# EAGLE design 30EC14-43EC14 (EAGLE 8.1.0)
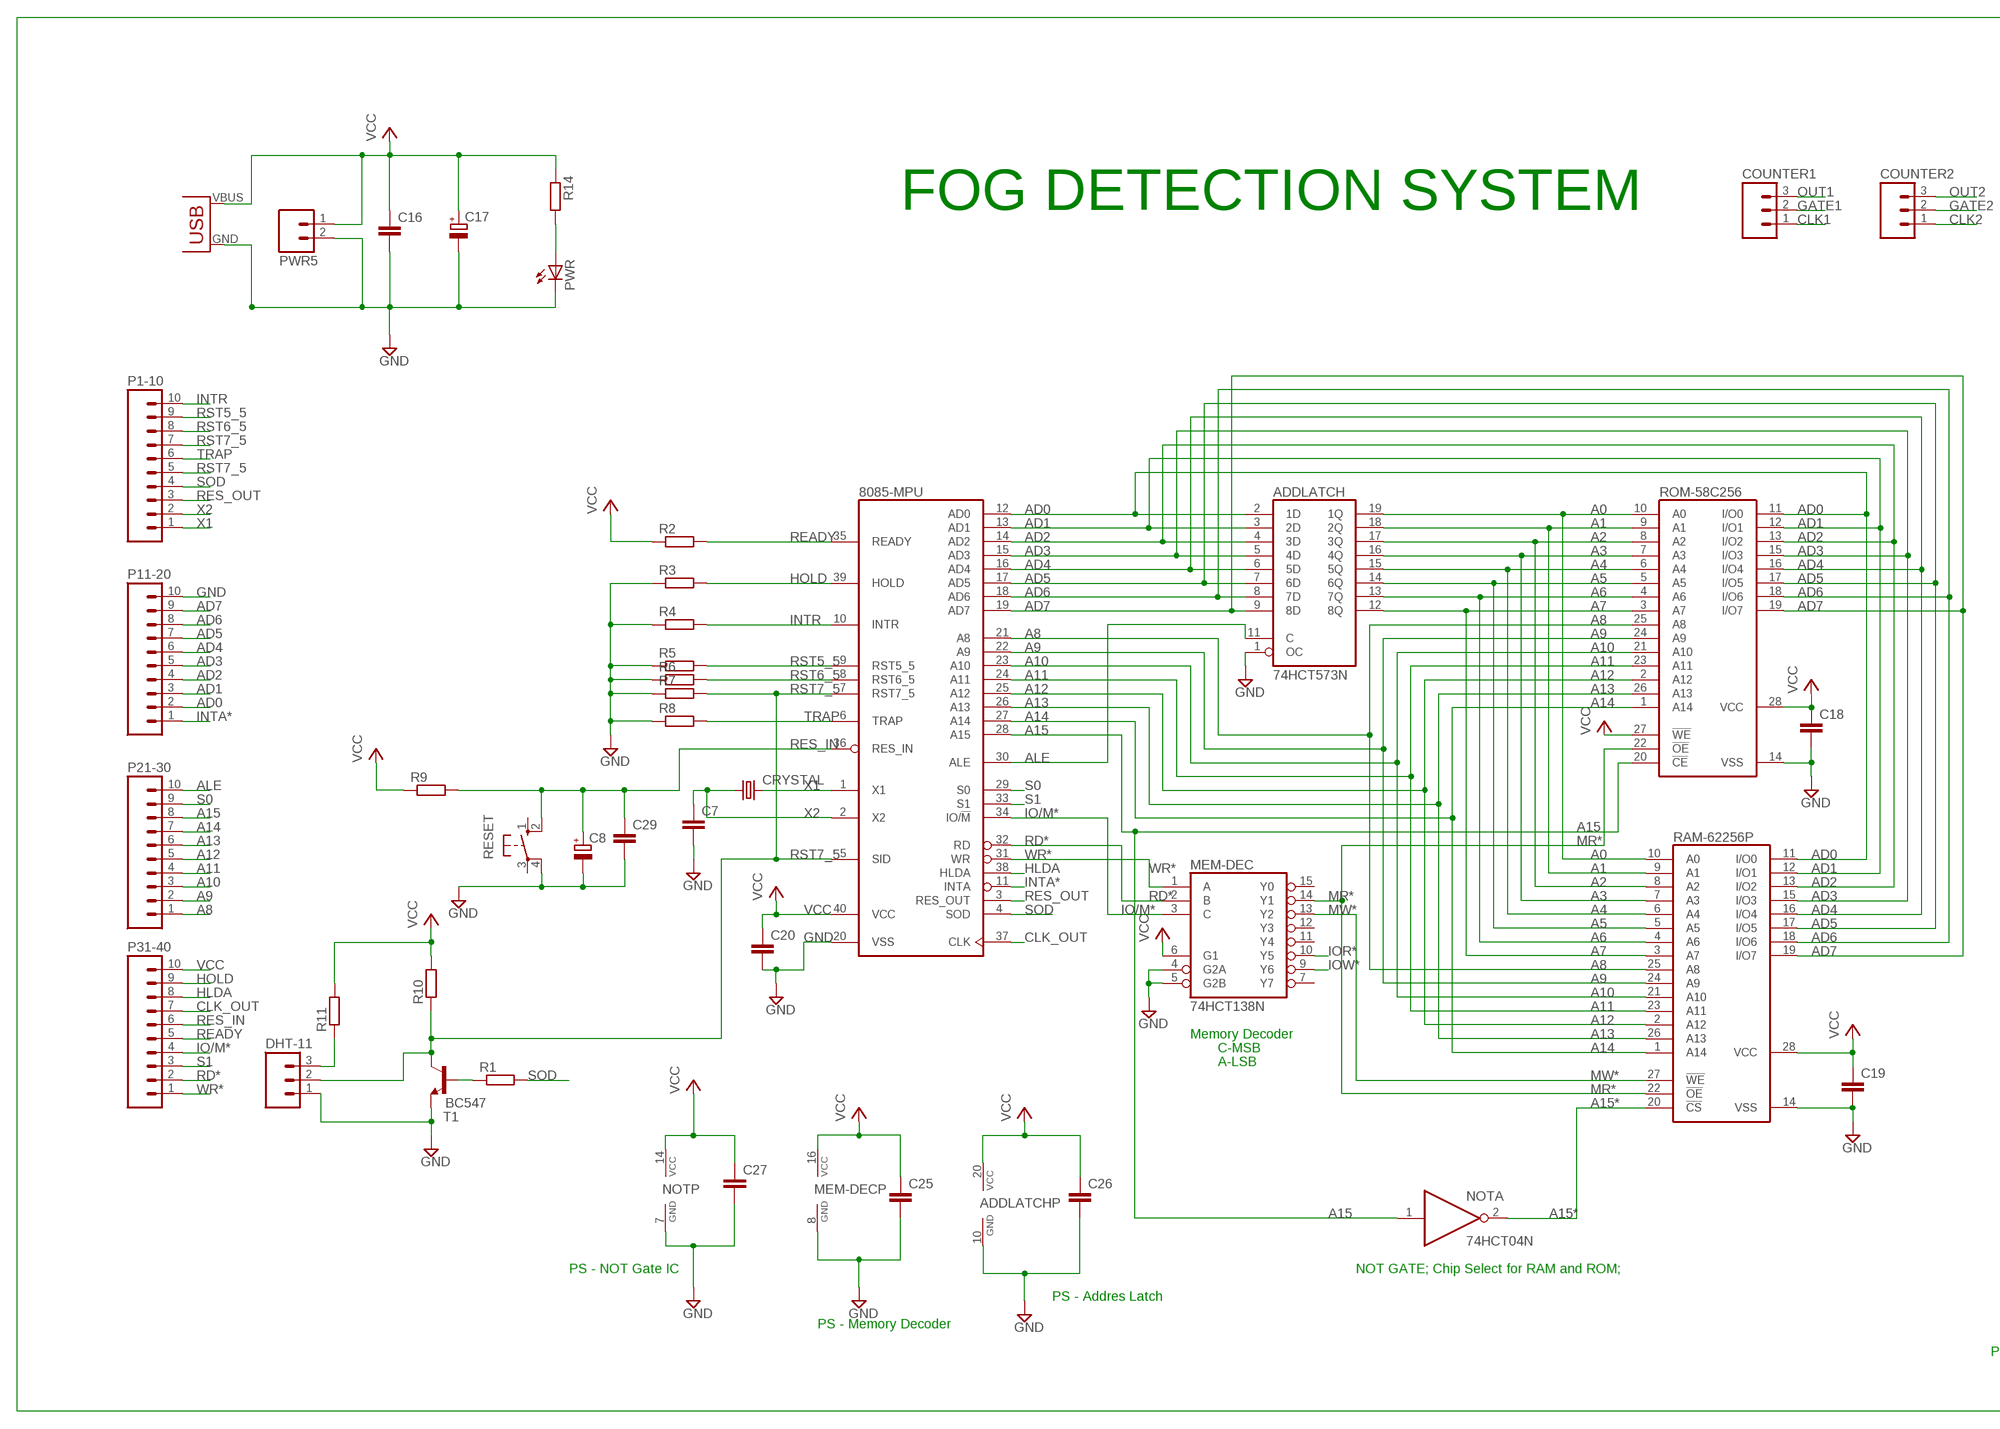
[diagram p0: schematic, sheet 1, part 1 of 2]
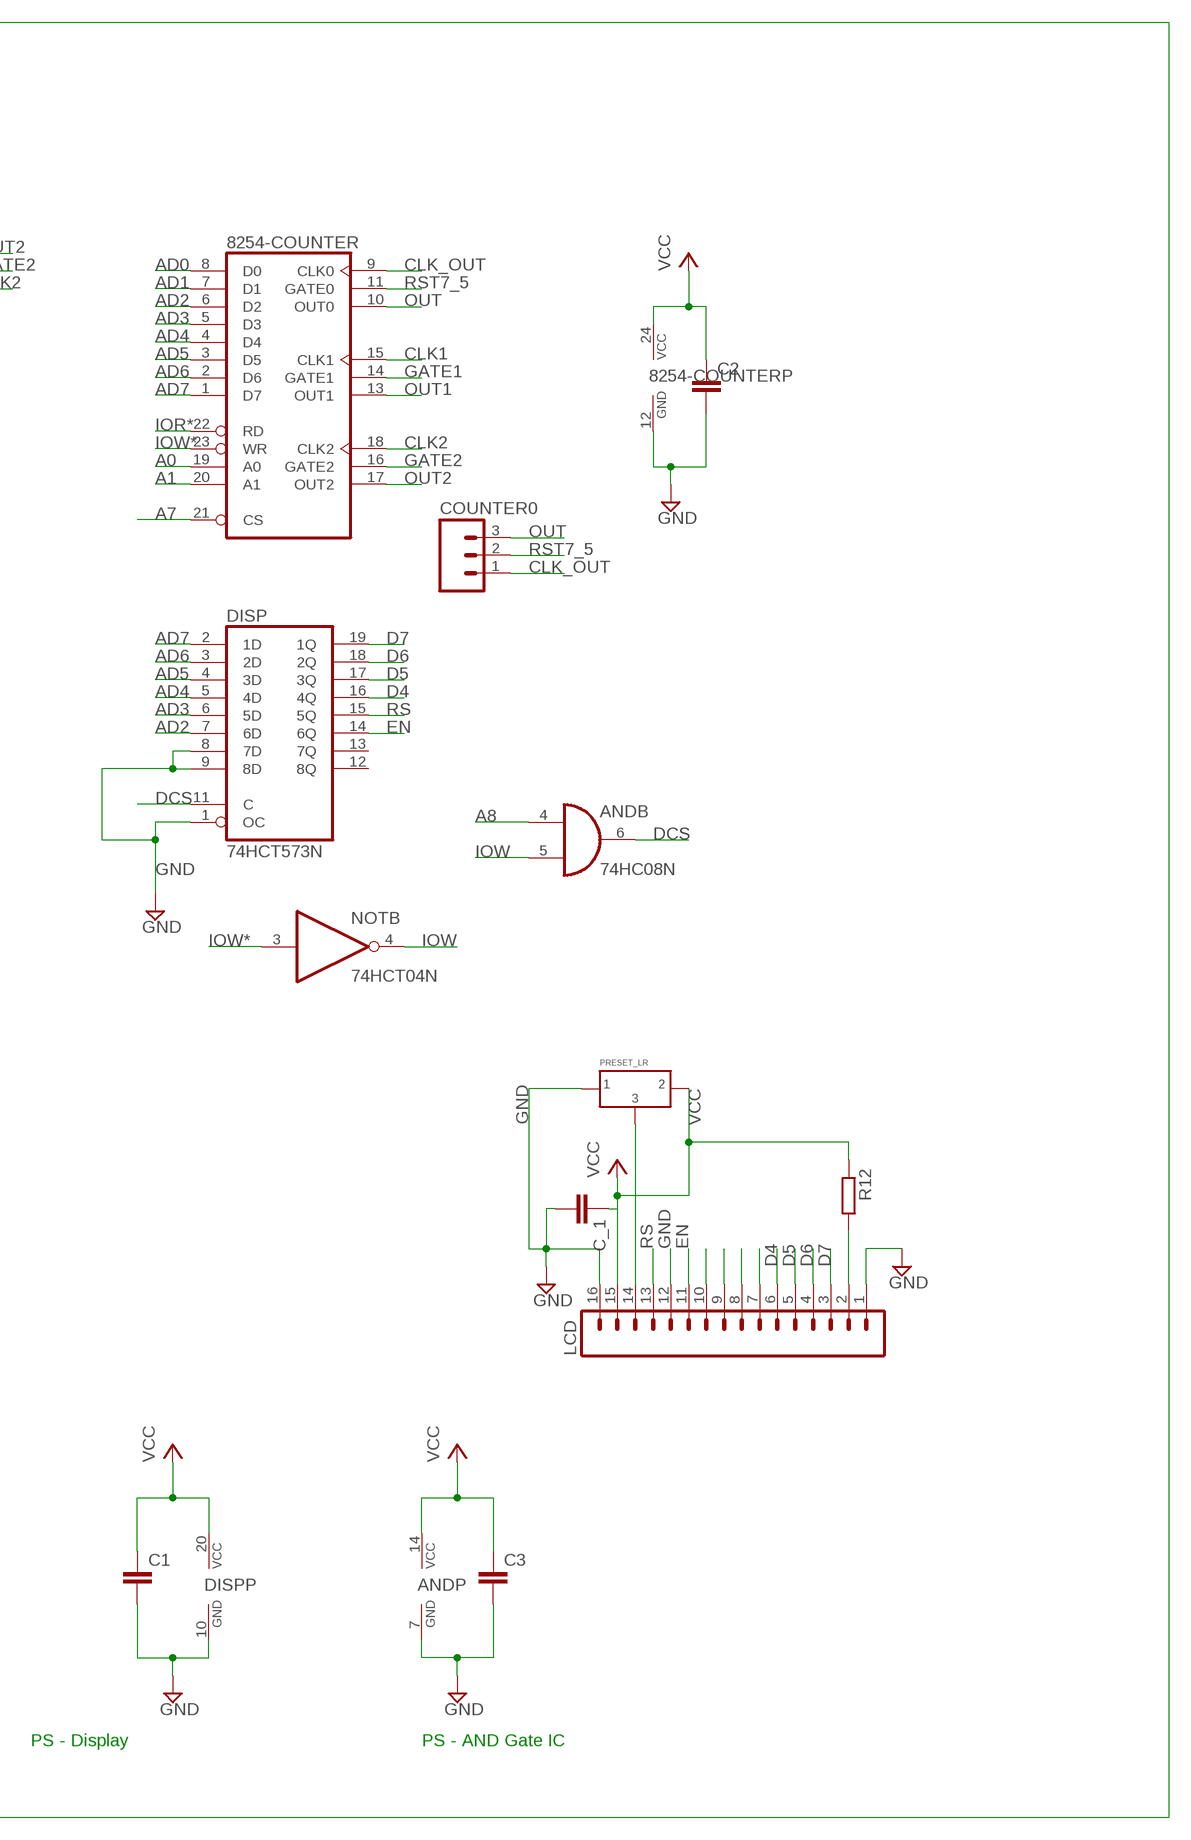
[diagram p1: schematic, sheet 1, part 2 of 2]

## Parts
8085-MPU  8085  [DIL40]
8254-COUNTER  8253  [DIL24-6]
ADDLATCH  74HCT573N  [DIL20]
AND  74HC08N  [DIL14]
C1  C-EU025-025X050  [C025-025X050]
C2  C-EU025-025X050  [C025-025X050]
C3  C-EU025-025X050  [C025-025X050]
C7  C-EU025-025X050  [C025-025X050]
C8  CPOL-EUE2.5-6  [E2,5-6]
C16  C-EU025-025X050  [C025-025X050]
C17  CPOL-EUE2.5-6  [E2,5-6]
C18  C-EU025-025X050  [C025-025X050]
C19  C-EU025-025X050  [C025-025X050]
C20  C-EU025-025X050  [C025-025X050]
C25  C-EU025-025X050  [C025-025X050]
C26  C-EU025-025X050  [C025-025X050]
C27  C-EU025-025X050  [C025-025X050]
C29  C-EU025-025X050  [C025-025X050]
C_1  C-EU025-024X044  [C025-024X044]
COUNTER0  M03  [03P]
COUNTER1  M03  [03P]
COUNTER2  M03  [03P]
CRYSTAL  CRYSTALHC49US  [HC49US]
DHT-11  M03  [03P]
DISP  74HCT573N  [DIL20]
LCD  M16  [16P]
MEM-DEC  74HCT138N  [DIL16]
NOT  74HCT04N  [DIL14]
P1-10  M10  [10P]
P11-20  M10  [10P]
P21-30  M10  [10P]
P31-40  M10  [10P]
PWR  LED5MM  [LED5MM]
PWR5  M02  [02P]
R1  R-EU_0204/7  [0204/7]
R2  R-EU_0204/7  [0204/7]
R3  R-EU_0204/7  [0204/7]
R4  R-EU_0204/7  [0204/7]
R5  R-EU_0204/7  [0204/7]
R6  R-EU_0204/7  [0204/7]
R7  R-EU_0204/7  [0204/7]
R8  R-EU_0204/7  [0204/7]
R9  R-EU_0204/7  [0204/7]
R10  R-EU_0204/7  [0204/7]
R11  R-EU_0204/7  [0204/7]
R12  R-EU_0204/7  [0204/7]
R14  R-EU_0204/7  [0204/7]
RAM-62256P  62256P  [DIL28-6]
RESET  10-XX  [B3F-10XX]
ROM-58C256  58C256P  [DIL28-6]
T1  BC547  [TO92]
U$1  PRESET_LR  [PRESET_LR]
USB  USB(POWER)  [USB(POWER)]

## Nets
A0: 8254-COUNTER.19(A0) ADDLATCH.19(1Q) RAM-62256P.10(A0) ROM-58C256.10(A0)
A1: 8254-COUNTER.20(A1) ADDLATCH.18(2Q) RAM-62256P.9(A1) ROM-58C256.9(A1)
A2: ADDLATCH.17(3Q) RAM-62256P.8(A2) ROM-58C256.8(A2)
A3: ADDLATCH.16(4Q) RAM-62256P.7(A3) ROM-58C256.7(A3)
A4: ADDLATCH.15(5Q) RAM-62256P.6(A4) ROM-58C256.6(A4)
A5: ADDLATCH.14(6Q) RAM-62256P.5(A5) ROM-58C256.5(A5)
A6: ADDLATCH.13(7Q) RAM-62256P.4(A6) ROM-58C256.4(A6)
A7: 8254-COUNTER.21(CS) ADDLATCH.12(8Q) RAM-62256P.3(A7) ROM-58C256.3(A7)
A8: 8085-MPU.21(A8) AND.4(B:I0) P21-30.1 RAM-62256P.25(A8) ROM-58C256.25(A8)
A9: 8085-MPU.22(A9) P21-30.2 RAM-62256P.24(A9) ROM-58C256.24(A9)
A10: 8085-MPU.23(A10) P21-30.3 RAM-62256P.21(A10) ROM-58C256.21(A10)
A11: 8085-MPU.24(A11) P21-30.4 RAM-62256P.23(A11) ROM-58C256.23(A11)
A12: 8085-MPU.25(A12) P21-30.5 RAM-62256P.2(A12) ROM-58C256.2(A12)
A13: 8085-MPU.26(A13) P21-30.6 RAM-62256P.26(A13) ROM-58C256.26(A13)
A14: 8085-MPU.27(A14) P21-30.7 RAM-62256P.1(A14) ROM-58C256.1(A14)
A15: 8085-MPU.28(A15) NOT.1(A:I) P21-30.8 ROM-58C256.20(!CE)
A15*: NOT.2(A:O) RAM-62256P.20(!CS)
AD0: 8085-MPU.12(AD0) 8254-COUNTER.8(D0) ADDLATCH.2(1D) P11-20.2 RAM-62256P.11(I/O0) ROM-58C256.11(I/O0)
AD1: 8085-MPU.13(AD1) 8254-COUNTER.7(D1) ADDLATCH.3(2D) P11-20.3 RAM-62256P.12(I/O1) ROM-58C256.12(I/O1)
AD2: 8085-MPU.14(AD2) 8254-COUNTER.6(D2) ADDLATCH.4(3D) DISP.7(6D) P11-20.4 RAM-62256P.13(I/O2) ROM-58C256.13(I/O2)
AD3: 8085-MPU.15(AD3) 8254-COUNTER.5(D3) ADDLATCH.5(4D) DISP.6(5D) P11-20.5 RAM-62256P.15(I/O3) ROM-58C256.15(I/O3)
AD4: 8085-MPU.16(AD4) 8254-COUNTER.4(D4) ADDLATCH.6(5D) DISP.5(4D) P11-20.6 RAM-62256P.16(I/O4) ROM-58C256.16(I/O4)
AD5: 8085-MPU.17(AD5) 8254-COUNTER.3(D5) ADDLATCH.7(6D) DISP.4(3D) P11-20.7 RAM-62256P.17(I/O5) ROM-58C256.17(I/O5)
AD6: 8085-MPU.18(AD6) 8254-COUNTER.2(D6) ADDLATCH.8(7D) DISP.3(2D) P11-20.8 RAM-62256P.18(I/O6) ROM-58C256.18(I/O6)
AD7: 8085-MPU.19(AD7) 8254-COUNTER.1(D7) ADDLATCH.9(8D) DISP.2(1D) P11-20.9 RAM-62256P.19(I/O7) ROM-58C256.19(I/O7)
ALE: 8085-MPU.30(ALE) ADDLATCH.11(C) P21-30.10
CLK1: 8254-COUNTER.15(CLK1) COUNTER1.1
CLK2: 8254-COUNTER.18(CLK2) COUNTER2.1
CLK_OUT: 8085-MPU.37(CLK) 8254-COUNTER.9(CLK0) COUNTER0.1 P31-40.7
D4: DISP.16(4Q) LCD.6
D5: DISP.17(3Q) LCD.5
D6: DISP.18(2Q) LCD.4
D7: DISP.19(1Q) LCD.3
DCS: AND.6(B:O) DISP.11(C)
EN: DISP.14(6Q) LCD.11
GATE1: 8254-COUNTER.14(GATE1) COUNTER1.2
GATE2: 8254-COUNTER.16(GATE2) COUNTER2.2
GND [power1]: 8085-MPU.20(VSS) 8254-COUNTER.12(GND) ADDLATCH.1(OC) ADDLATCH.10(GND) AND.7(P:GND) C1.2 C2.2 C3.2 C7.2 C8.- C16.2 C17.- C18.2 C19.2 C20.2 C25.2 C26.2 C27.2 C29.2 C_1.2 DHT-11.1 DISP.1(OC) DISP.8(7D) DISP.9(8D) DISP.10(GND) LCD.1 LCD.12 LCD.16 MEM-DEC.4(G2A) MEM-DEC.5(G2B) MEM-DEC.8(GND) NOT.7(P:GND) P11-20.10 PWR5.2 PWR.K(C) R3.1 R4.1 R5.1 R6.1 R7.1 R8.1 RAM-62256P.14(VSS) RESET.4(P1) ROM-58C256.14(VSS) T1.1(E) U$1.P$1 USB.GND
HLDA: 8085-MPU.38(HLDA) P31-40.8
HOLD: 8085-MPU.39(HOLD) P31-40.9 R3.2
INTA*: 8085-MPU.11(INTA) P11-20.1
INTR: 8085-MPU.10(INTR) P1-10.10 R4.2
IO/M*: 8085-MPU.34(IO/!M) MEM-DEC.3(C) P31-40.4
IOR*: 8254-COUNTER.22(RD) MEM-DEC.10(Y5)
IOW: AND.5(B:I1) NOT.4(B:O)
IOW*: 8254-COUNTER.23(WR) MEM-DEC.9(Y6) NOT.3(B:I)
MR*: MEM-DEC.14(Y1) RAM-62256P.22(!OE) ROM-58C256.22(!OE)
MW*: MEM-DEC.13(Y2) RAM-62256P.27(!WE)
N$4: LCD.14 U$1.P$3
N$5: DHT-11.3 R11.1
N$7: R1.1 T1.2(B)
N$10: LCD.10
N$11: LCD.9
N$12: LCD.8
N$13: LCD.7
N$18: LCD.2 R12.2
N$39: PWR.A R14.2
OUT: 8254-COUNTER.10(OUT0) COUNTER0.3
OUT1: 8254-COUNTER.13(OUT1) COUNTER1.3
OUT2: 8254-COUNTER.17(OUT2) COUNTER2.3
RD*: 8085-MPU.32(RD) MEM-DEC.2(B) P31-40.2
READY: 8085-MPU.35(READY) P31-40.5 R2.2
RES_IN: 8085-MPU.36(RES_IN) C8.+ C29.1 P31-40.6 R9.2 RESET.2(S1)
RES_OUT: 8085-MPU.3(RES_OUT) P1-10.3
RS: DISP.15(5Q) LCD.13
RST5_5: 8085-MPU.9(RST5_5) P1-10.9 R5.2
RST6_5: 8085-MPU.8(RST6_5) P1-10.8 R6.2
RST7_5: 8085-MPU.5(SID) 8085-MPU.7(RST7_5) 8254-COUNTER.11(GATE0) COUNTER0.2 DHT-11.2 P1-10.5 P1-10.7 R7.2 R10.1 T1.3(C)
S0: 8085-MPU.29(S0) P21-30.9
S1: 8085-MPU.33(S1) P31-40.3
SOD: 8085-MPU.4(SOD) P1-10.4 R1.2
TRAP: 8085-MPU.6(TRAP) P1-10.6 R8.2
VCC [power1]: 8085-MPU.40(VCC) 8254-COUNTER.24(VCC) ADDLATCH.20(VCC) AND.14(P:VCC) C1.1 C2.1 C3.1 C16.1 C17.+ C18.1 C19.1 C20.1 C25.1 C26.1 C27.1 C_1.1 DISP.20(VCC) LCD.15 MEM-DEC.6(G1) MEM-DEC.16(VCC) NOT.14(P:VCC) P31-40.10 PWR5.1 R2.1 R9.1 R10.2 R11.2 R12.1 R14.1 RAM-62256P.28(VCC) ROM-58C256.27(!WE) ROM-58C256.28(VCC) U$1.P$2 USB.VBUS(VCC)
WR*: 8085-MPU.31(WR) MEM-DEC.1(A) P31-40.1
X1: 8085-MPU.1(X1) CRYSTAL.2 P1-10.1
X2: 8085-MPU.2(X2) C7.1 CRYSTAL.1 P1-10.2
Unconnected: AND.1(A:I0) AND.2(A:I1) AND.3(A:O) AND.8(C:O) AND.9(C:I0) AND.10(C:I1) AND.11(D:O) AND.12(D:I0) AND.13(D:I1) DISP.12(8Q) DISP.13(7Q) MEM-DEC.7(Y7) MEM-DEC.11(Y4) MEM-DEC.12(Y3) MEM-DEC.15(Y0) NOT.5(C:I) NOT.6(C:O) NOT.8(D:O) NOT.9(D:I) NOT.10(E:O) NOT.11(E:I) NOT.12(F:O) NOT.13(F:I) RESET.1(S) RESET.3(P)

## Notes on the sheet
- FOG DETECTION SYSTEM
- Memory Decoder
- C-MSB
- A-LSB
- PS - NOT Gate IC | NOT GATE; Chip Select for RAM and ROM;
- PS - Addres Latch
- PS - Memory Decoder
- PS - Display | PS - AND Gate IC

## Library data of the parts
8085-MPU = micro-intel:8085: MICROCOMPUTER/PERIPHERAL DEVICE; OC_FARNELL: unknown; OC_NEWARK: unknown
8254-COUNTER = micro-intel:8253: MICROCOMPUTER/PERIPHERAL DEVICE; OC_FARNELL: unknown; OC_NEWARK: unknown
ADDLATCH DISP = 74xx-eu:74*573: 8-bit D latch BUS DRIVER
AND = 74xx-eu:74*08: Quad 2-input AND gate
C1 C3 C16 C18-C20 C25-C27 = resistor:C-EU: CAPACITOR, European symbol
C2 C7 C29 C_1 = rcl:C-EU: CAPACITOR, European symbol
C8 C17 = rcl:CPOL-EU: POLARIZED CAPACITOR, European symbol
COUNTER0 COUNTER1 COUNTER2 DHT-11 = con-amp-quick:M03: AMP QUICK CONNECTOR; OC_FARNELL: unknown; OC_NEWARK: unknown
CRYSTAL = CEDT_JANUARY_2015_v5:CRYSTAL: Crystals Various standard crystals. Proven footprints. Spark Fun Electronics SKU : COM-00534
LCD = con-amp-quick:M16: AMP QUICK CONNECTOR; OC_FARNELL: unknown; OC_NEWARK: unknown
MEM-DEC = 74xx-eu:74*138: 3-line to 8-line DECODER/DEMULTIPLEXER
NOT = 74xx-eu:74*04: Hex INVERTER
P1-10 P11-20 P21-30 P31-40 = con-amp-quick:M10: AMP QUICK CONNECTOR; OC_FARNELL: unknown; OC_NEWARK: unknown
PWR = CEDTv79:LED
PWR5 = CEDT_JANUARY_2015_v5:M02: AMP QUICK CONNECTOR
R1 R9-R11 = resistor:R-EU_: RESISTOR, European symbol
R2-R8 R12 R14 = rcl:R-EU_: RESISTOR, European symbol
RAM-62256P = memory-hitachi:62256P: MEMORY; OC_FARNELL: unknown; OC_NEWARK: unknown
RESET = switch-omron:10-XX: OMRON SWITCH; MPN: B3F-1000; OC_FARNELL: 176432; OC_NEWARK: 36M3542
ROM-58C256 = memory-hitachi:58C256P: MEMORY; MPN: HN58C256AP85E; OC_FARNELL: 1496447; OC_NEWARK: 61M6616
T1 = transistor:BC547: NPN TRANSISTOR
U$1 = CEDT_JANUARY_2015_v5:PRESET_LR
USB = CEDT_JANUARY_2015_v5:USB(POWER)

## Net classes
0 default: width 0.356 mm, clearance 0.2 mm
1 power1: width 0.61 mm, clearance 0.2 mm
2 powermotor: width 0.762 mm, clearance 0.2 mm

## Board
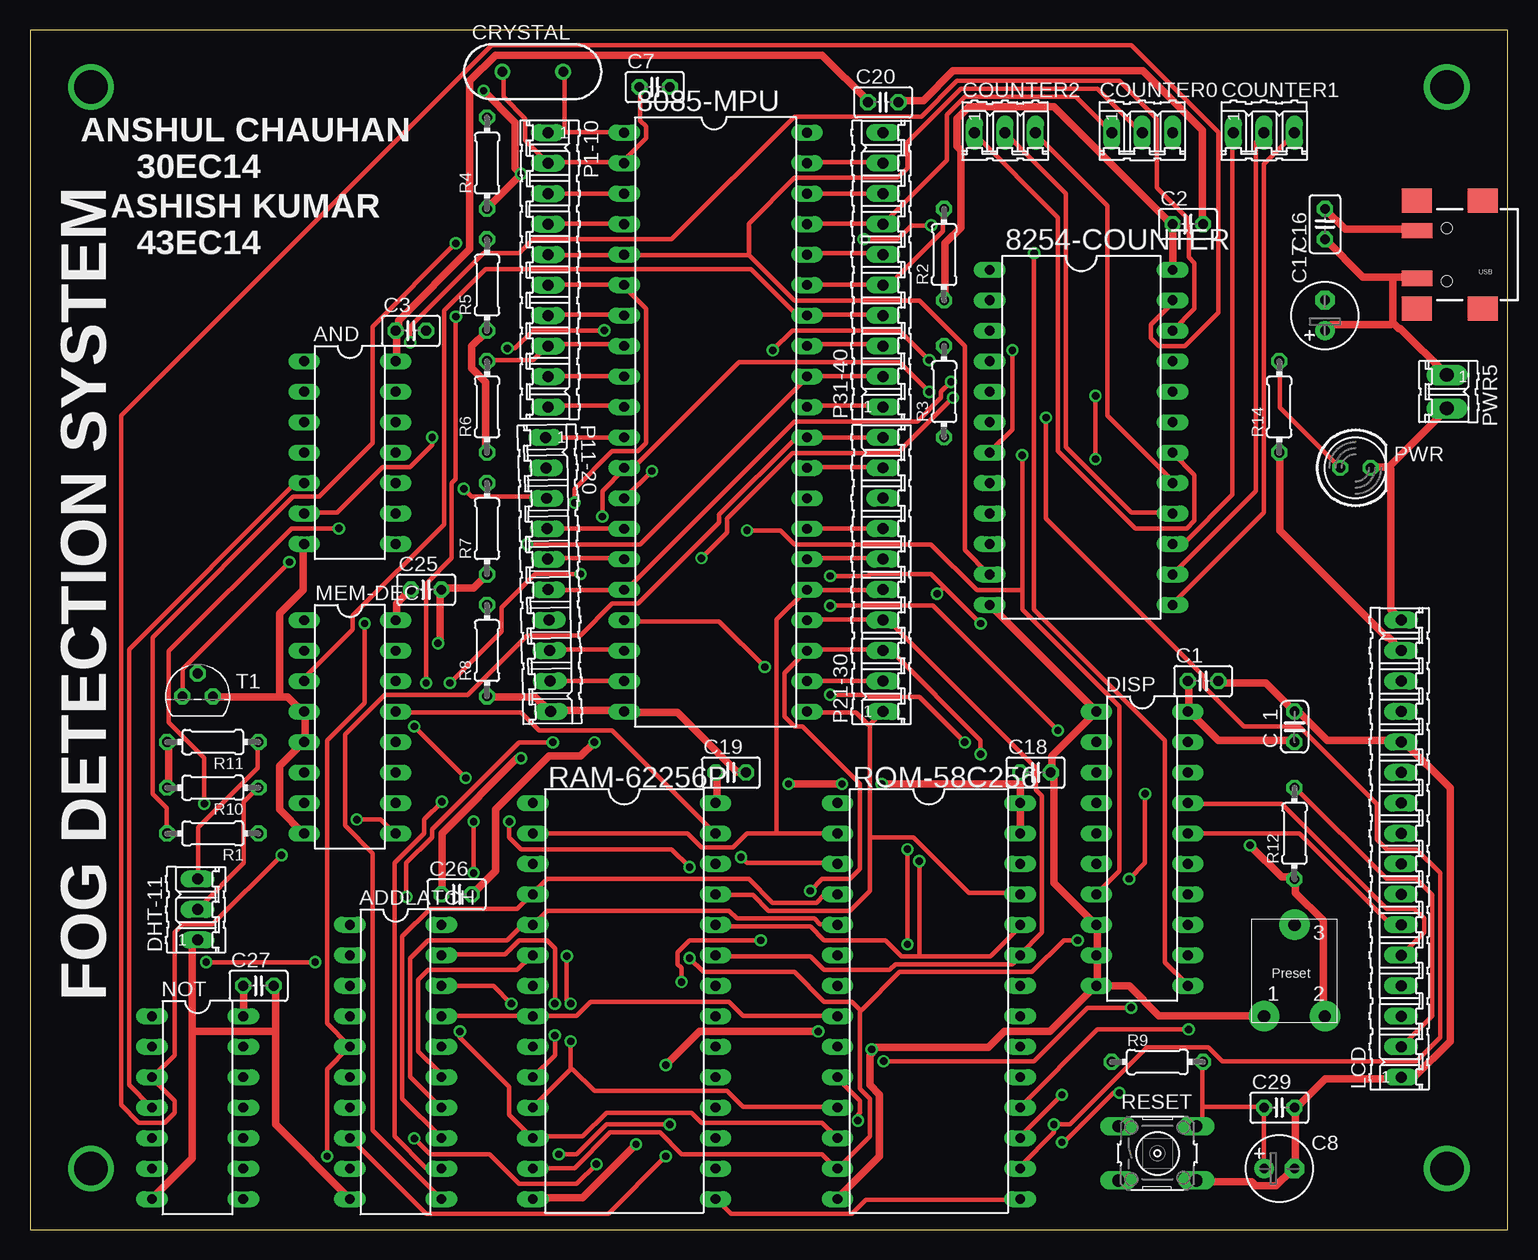
[diagram p2: board, top side]
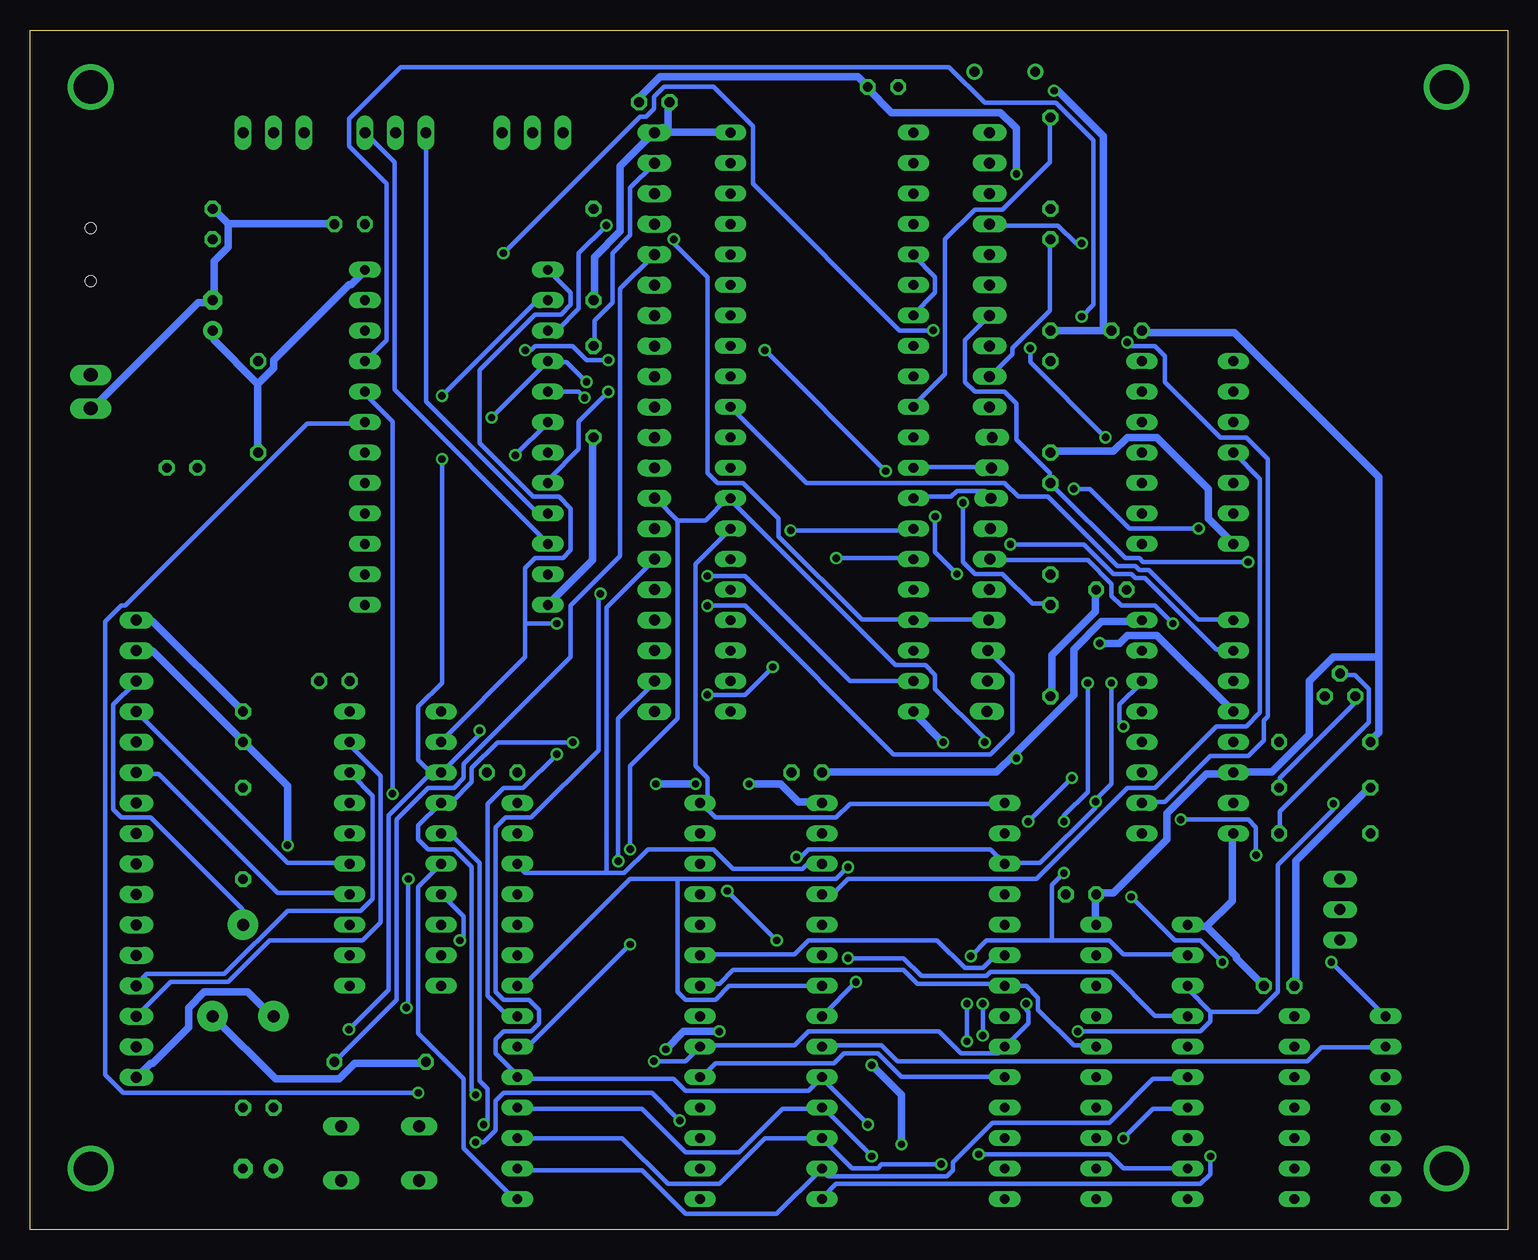
[diagram p3: board, bottom side, seen from below]

Size 123.17 x 100 mm. Coordinates in mm from the lower left corner, seen from the top.
Outline: 0,0 123.17,0 123.17,100 0,100 0,0
Copper layers (1*16): Top 0.035mm / dielectric 1.5mm / Bottom 0.035mm
Design rules "default *": minimum track width 10mil, minimum drill 24mil, track to track 12mil, track to pad 12mil, pad to pad 12mil, via to via 12mil, smd to smd 12mil, copper to edge 40mil, drill to drill 8mil, minimum pad ring 10mil, minimum via ring 8mil, stop-mask expansion 4mil, vias tented up to drill 0mil, thermal gap 10mil

### Footprints (pad centres in the part's own frame; a part is rotated, then mirrored left to right if it is on the bottom)
DIL40 = drill 0.813 long: 1 -24.13,-7.62; 2 -21.59,-7.62; 3 -19.05,-7.62; 4 -16.51,-7.62; 5 -13.97,-7.62; 6 -11.43,-7.62; 7 -8.89,-7.62; 8 -6.35,-7.62; 9 -3.81,-7.62; 10 -1.27,-7.62; 11 1.27,-7.62; 12 3.81,-7.62; 13 6.35,-7.62; 14 8.89,-7.62; 15 11.43,-7.62; 16 13.97,-7.62; 17 16.51,-7.62; 18 19.05,-7.62; 19 21.59,-7.62; 20 24.13,-7.62; 21 24.13,7.62; 22 21.59,7.62; 23 19.05,7.62; 24 16.51,7.62; 25 13.97,7.62; 26 11.43,7.62; 27 8.89,7.62; 28 6.35,7.62; 29 3.81,7.62; 30 1.27,7.62; 31 -1.27,7.62; 32 -3.81,7.62; 33 -6.35,7.62; 34 -8.89,7.62; 35 -11.43,7.62; 36 -13.97,7.62; 37 -16.51,7.62; 38 -19.05,7.62; 39 -21.59,7.62; 40 -24.13,7.62
DIL24-6 = drill 0.813 long: 1 -13.97,-7.62; 2 -11.43,-7.62; 3 -8.89,-7.62; 4 -6.35,-7.62; 5 -3.81,-7.62; 6 -1.27,-7.62; 7 1.27,-7.62; 8 3.81,-7.62; 9 6.35,-7.62; 10 8.89,-7.62; 11 11.43,-7.62; 12 13.97,-7.62; 13 13.97,7.62; 14 11.43,7.62; 15 8.89,7.62; 16 6.35,7.62; 17 3.81,7.62; 18 1.27,7.62; 19 -1.27,7.62; 20 -3.81,7.62; 21 -6.35,7.62; 22 -8.89,7.62; 23 -11.43,7.62; 24 -13.97,7.62
DIL20 = drill 0.813 long: 1 -11.43,-3.81; 2 -8.89,-3.81; 3 -6.35,-3.81; 4 -3.81,-3.81; 5 -1.27,-3.81; 6 1.27,-3.81; 7 3.81,-3.81; 8 6.35,-3.81; 9 8.89,-3.81; 10 11.43,-3.81; 11 11.43,3.81; 12 8.89,3.81; 13 6.35,3.81; 14 3.81,3.81; 15 1.27,3.81; 16 -1.27,3.81; 17 -3.81,3.81; 18 -6.35,3.81; 19 -8.89,3.81; 20 -11.43,3.81
DIL14 = drill 0.813 long: 1 -7.62,-3.81; 2 -5.08,-3.81; 3 -2.54,-3.81; 4 0,-3.81; 5 2.54,-3.81; 6 5.08,-3.81; 7 7.62,-3.81; 8 7.62,3.81; 9 5.08,3.81; 10 2.54,3.81; 11 0,3.81; 12 -2.54,3.81; 13 -5.08,3.81; 14 -7.62,3.81
C025-025X050 = drill 0.813 octagon: 1 -1.27,0; 2 1.27,0
E2,5-6 = drill 0.813 pad 1.6: + -1.27,0 | drill 0.813 pad 1.6 octagon: - 1.27,0
C025-024X044 = drill 0.813 octagon: 1 -1.27,0; 2 1.27,0
03P = drill 0.914 long: 1 -2.54,0; 2 0,0; 3 2.54,0
HC49US = drill 0.813: 1 -2.54,0; 2 2.54,0
16P = drill 0.914 long: 1 -19.05,0; 2 -16.51,0; 3 -13.97,0; 4 -11.43,0; 5 -8.89,0; 6 -6.35,0; 7 -3.81,0; 8 -1.27,0; 9 1.27,0; 10 3.81,0; 11 6.35,0; 12 8.89,0; 13 11.43,0; 14 13.97,0; 15 16.51,0; 16 19.05,0
DIL16 = drill 0.813 long: 1 -8.89,-3.81; 2 -6.35,-3.81; 3 -3.81,-3.81; 4 -1.27,-3.81; 5 1.27,-3.81; 6 3.81,-3.81; 7 6.35,-3.81; 8 8.89,-3.81; 9 8.89,3.81; 10 6.35,3.81; 11 3.81,3.81; 12 1.27,3.81; 13 -1.27,3.81; 14 -3.81,3.81; 15 -6.35,3.81; 16 -8.89,3.81
10P = drill 0.914 long: 1 -11.43,0; 2 -8.89,0; 3 -6.35,0; 4 -3.81,0; 5 -1.27,0; 6 1.27,0; 7 3.81,0; 8 6.35,0; 9 8.89,0; 10 11.43,0
LED5MM = drill 0.813 octagon: A -1.27,0; K 1.27,0
02P = drill 1.143 long: 1 -1.397,0; 2 1.397,0
0204/7 = drill 0.813 octagon: 1 -3.81,0; 2 3.81,0
DIL28-6 = drill 0.813 long: 1 -16.51,-7.62; 2 -13.97,-7.62; 3 -11.43,-7.62; 4 -8.89,-7.62; 5 -6.35,-7.62; 6 -3.81,-7.62; 7 -1.27,-7.62; 8 1.27,-7.62; 9 3.81,-7.62; 10 6.35,-7.62; 11 8.89,-7.62; 12 11.43,-7.62; 13 13.97,-7.62; 14 16.51,-7.62; 15 16.51,7.62; 16 13.97,7.62; 17 11.43,7.62; 18 8.89,7.62; 19 6.35,7.62; 20 3.81,7.62; 21 1.27,7.62; 22 -1.27,7.62; 23 -3.81,7.62; 24 -6.35,7.62; 25 -8.89,7.62; 26 -11.43,7.62; 27 -13.97,7.62; 28 -16.51,7.62
B3F-10XX = drill 1.016 long: 1 -3.251,2.261; 2 3.251,2.261; 3 -3.251,-2.261; 4 3.251,-2.261
TO92 = drill 0.813 octagon: 1 1.27,0; 2 0,1.905; 3 -1.27,0
PRESET_LR = drill 1.016 pad 2.54: P$1 -2.54,-3.81; P$2 2.54,-3.81; P$3 0,3.81
USB(POWER) = smd 2.54 x 1.27: GND 2.5,-1.981; VBUS 2.5,1.981 | smd 2.5 x 2: GND@1 -3,-4.5; GND@2 -3,4.5; GND@3 2.5,4.5; GND@4 2.5,-4.5 | hole 0.9: 0,2.2; 0,-2.2

### Placement (x,y rotation side)
8085-MPU  57.15,67.31 270 top
8254-COUNTER  87.63,66.04 270 top
ADDLATCH  30.48,13.97 270 top
AND  26.67,64.77 270 top
C1  97.79,45.72 0 top
C2  96.52,83.82 0 top
C3  31.75,74.93 0 top
C7  52.07,95.25 0 top
C8  104.14,5.08 0 top
C16  107.95,83.82 90 top
C17  107.95,76.2 90 top
C18  83.82,38.1 0 top
C19  58.42,38.1 0 top
C20  71.12,93.98 0 top
C25  33.02,53.34 0 top
C26  35.56,27.94 0 top
C27  19.05,20.32 0 top
C29  104.14,10.16 0 top
C_1  105.41,41.91 90 top
COUNTER0  92.71,91.44 0 top
COUNTER1  102.87,91.44 0 top
COUNTER2  81.28,91.44 0 top
CRYSTAL  41.91,96.52 0 top
DHT-11  13.97,26.67 90 top
DISP  92.71,31.75 270 top
LCD  114.3,31.75 90 top
MEM-DEC  26.67,41.91 270 top
NOT  13.97,10.16 270 top
P1-10  43.18,80.01 270 top
P11-20  43.18,54.61 271.1 top
P21-30  71.12,54.61 90 top
P31-40  71.12,80.01 90 top
PWR  110.49,63.5 0 top
PWR5  118.11,69.85 270 top
R1  15.24,33.02 180 top
R2  76.2,81.28 90 top
R3  76.2,69.85 90 top
R4  38.1,88.9 90 top
R5  38.1,78.74 90 top
R6  38.1,68.58 90 top
R7  38.1,58.42 90 top
R8  38.1,48.26 90 top
R9  93.98,13.97 0 top
R10  15.24,36.83 180 top
R11  15.24,40.64 180 top
R12  105.41,33.02 90 top
R14  104.14,68.58 90 top
RAM-62256P  49.53,19.05 270 top
RESET  93.98,6.35 0 top
ROM-58C256  74.93,19.05 270 top
T1  13.97,44.45 0 top
U$1  105.41,21.59 0 top
USB  118.11,81.28 180 top

### Tracks (layer width: path | path; a pad name or v marks a point on that pad's centre or on a via)
A0  (via drill 0.61)
  Top 0.356: v43.75,18.82 43.75,23.44 43.09,24.11 40.78,24.11 39.62,22.95 34.34,22.95 ADDLATCH.19 | v43.75,16.18 43.75,14.53 41.94,12.71 RAM-62256P.10 | v90.81,11.39 90.31,11.39 86.18,7.26 v86.02,7.26 | v69.01,9.08 69.01,9.58 69.18,9.74 69.18,10.73 67.36,12.55 ROM-58C256.10
  Bottom 0.356: RAM-62256P.10 41.94,12.71 50.52,12.71 52.5,14.69 55.31,14.69 56.13,13.87 66.04,13.87 67.2,12.71 ROM-58C256.10 | v43.75,16.18 v43.75,18.82 | v90.81,11.39 115.41,11.39 116.89,12.88 116.89,50.69 115.57,52.01 115.24,52.01 100.05,67.2 95.26,67.2 8254-COUNTER.19 | v86.02,7.26 85.36,7.26 84.37,8.26 84.37,10.73 83.71,11.39 71.32,11.39 v69.01,9.08
A1  (via drill 0.61)
  Top 0.356: v40.12,18.82 38.63,20.31 34.34,20.31 ADDLATCH.18 | v92.95,36.32 92.95,30.54 v91.63,29.22 | v91.8,18.49 88.16,18.49 83.71,14.03 v71.16,14.03
  Bottom 0.356: v40.12,18.82 40.12,18.33 39.95,18.16 39.95,17.17 41.77,15.35 RAM-62256P.9 41.94,15.19 42.43,14.69 45.57,14.69 47.38,16.51 58.28,16.51 59.44,15.35 67.2,15.35 ROM-58C256.9 68.52,14.03 v71.16,14.03 | v92.95,36.32 92.95,67.36 95.1,69.51 95.1,69.84 8254-COUNTER.20 | v91.63,29.22 91.63,18.66 v91.8,18.49
A2
  Top 0.356: ADDLATCH.17 34.34,17.83 41.77,17.83 RAM-62256P.8 41.94,17.83 45.57,17.83 46.72,18.99 58.28,18.99 59.44,17.83 67.2,17.83 ROM-58C256.8
A3
  Bottom 0.356: ADDLATCH.16 34.34,15.35 36.16,15.35 39.13,18.33 39.13,19.32 40.12,20.31 41.77,20.31 RAM-62256P.7 41.94,20.47 49.2,20.47 50.35,21.63 64.55,21.63 65.71,20.47 67.2,20.47 ROM-58C256.7
A4
  Top 0.356: ADDLATCH.15 34.18,12.71 34.18,13.04 32.36,14.86 32.36,20.8 33.19,21.63 40.62,21.63 41.77,22.78 RAM-62256P.6
  Bottom 0.356: ROM-58C256.6 67.2,22.95 59.44,22.95 58.28,24.11 47.55,24.11 45.24,21.79 43.75,21.79 42.76,22.78 41.94,22.78 RAM-62256P.6
A5
  Top 0.356: ADDLATCH.14 34.18,10.24 31.7,12.71 31.7,22.62 33.19,24.11 39.79,24.11 40.95,25.26 41.77,25.26 RAM-62256P.5 43.09,26.58 58.28,26.58 58.94,25.92 65.38,25.92 65.88,25.43 67.2,25.43 ROM-58C256.5
A6
  Top 0.356: ADDLATCH.13 34.18,7.76 31.04,10.9 31.04,24.43 33.35,26.75 40.62,26.75 41.77,27.9 RAM-62256P.4 41.94,28.07 43.09,29.22 59.93,29.22 61.91,27.24 65.55,27.24 66.2,27.9 67.2,27.9 ROM-58C256.4
A7  (via drill 0.61)
  Top 0.356: v34.34,35.66 32.85,34.18 32.85,33.02 30.38,30.54 30.38,7.76 33.02,5.12 34.18,5.12 ADDLATCH.12 | v59.27,31.04 59.77,30.54 67.2,30.54 ROM-58C256.3 | v35.5,76.11 35.5,62.57 35.17,62.24 35.17,55.97 33.02,53.82 v33.02,45.57
  Bottom 0.356: v59.27,31.04 58.94,31.04 58.28,31.7 43.09,31.7 41.94,30.54 RAM-62256P.3 41.77,30.54 38.96,30.54 34.34,35.17 v34.34,35.66 34.34,35.83 33.02,37.15 v33.02,45.57 | v35.5,76.11 34.51,77.1 34.51,90.81 37.64,93.94 43.59,93.94 46.56,96.91 92.29,96.91 96.58,92.62 96.58,90.31 93.45,87.17 93.45,74.13 95.1,72.48 8254-COUNTER.21
A8
  Top 0.356: 70,42.1 70,32.69 | 70,32.69 70,28.23 68.35,26.58 61.58,26.58 60.26,27.9 57.29,27.9 RAM-62256P.25 | 70,42.1 70.99,43.09 P21-30.1 | 70,32.69 73.64,32.69 78.26,28.07 82.55,28.07 ROM-58C256.25 | 8085-MPU.21 64.88,43.09 68.85,43.09 69.84,42.1 70,42.1
  Bottom 0.356: AND.4 22.78,64.72 20.64,62.57 20.64,43.09 21.79,41.94 24.27,41.94 29.39,36.82 31.7,36.82 39.29,29.22 54.98,29.22 56.13,28.07 57.12,28.07 RAM-62256P.25
A9  (via drill 0.61)
  Top 0.356: 8085-MPU.22 64.88,45.73 70.99,45.73 P21-30.2 | 74.13,22.78 80.07,22.78 82.55,25.26 ROM-58C256.24 | 74.13,22.78 72.64,22.78 71.32,24.11 66.2,24.11 65.05,25.26 57.29,25.26 RAM-62256P.24 | 74.13,22.78 v74.13,30.71
  Bottom 0.356: v74.13,30.71 74.13,42.6 71.16,45.57 P21-30.2
A10  (via drill 0.61)
  Top 0.356: v54.32,20.64 54.32,21.79 53.99,22.12 53.99,23.11 54.98,24.11 v60.92,24.11 | v65.05,28.23 66.04,29.22 68.35,29.22 69.18,30.05 69.18,37.15 64.39,41.94 63.73,41.94 62.9,42.76 62.9,46.39 8085-MPU.23 64.88,48.37 70.99,48.37 P21-30.3 71.16,48.21 71.82,48.21 79.25,40.78 v79.25,39.62
  Bottom 0.356: v54.32,20.64 57.12,17.83 RAM-62256P.21 | v65.05,28.23 v60.92,24.11 | v79.25,39.62 82.06,36.82 83.71,36.82 85.03,35.5 85.03,19.48 83.38,17.83 82.55,17.83 ROM-58C256.21
A11
  Top 0.356: 8085-MPU.24 64.88,50.85 70.99,50.85 P21-30.4 71.16,50.69 71.65,50.69 83.87,38.47 83.87,36.65 84.37,36.16 84.37,24.77 82.55,22.95 ROM-58C256.23 82.55,22.78 81.89,22.12 72.15,22.12 71.65,21.63 66.2,21.63 65.05,22.78 57.29,22.78 RAM-62256P.23
A12
  Top 0.356: P21-30.5 70.99,53.33 64.88,53.33 8085-MPU.25 64.72,53.33 62.24,50.85 62.24,33.02 | RAM-62256P.2 54.81,33.02 55.97,31.86 58.61,31.86 59.77,33.02 62.24,33.02 | ROM-58C256.2 62.24,33.02
A13
  Top 0.356: 8085-MPU.26 64.88,55.97 70.99,55.97 P21-30.6
  Bottom 0.356: 75.12,29.72 81.89,29.72 82.55,30.38 ROM-58C256.26 | 75.12,29.72 73.64,29.72 71.65,31.7 66.2,31.7 64.55,30.05 58.78,30.05 58.45,30.38 57.29,30.38 RAM-62256P.26 | 75.12,29.72 75.12,51.84 71.16,55.8 P21-30.6
A14
  Top 0.356: 8085-MPU.27 64.88,58.45 70.99,58.45 P21-30.7
  Bottom 0.356: RAM-62256P.1 41.94,35.5 54.81,35.5 55.97,34.34 66.04,34.34 67.2,35.5 ROM-58C256.1 67.2,35.66 66.7,36.16 66.7,37.64 67.69,38.63 67.69,55.47 64.88,58.28 8085-MPU.27
A15  (via drill 0.61)
  Top 0.356: v73.14,31.7 v73.14,23.77 | v23.77,22.29 v14.69,22.29 | v31.37,27.74 31.37,30.54 33.52,32.69 33.52,33.35 40.78,40.62 v43.59,40.62
  Bottom 0.356: v73.14,23.77 81.56,15.35 82.55,15.35 ROM-58C256.20 | v73.14,31.7 73.14,38.63 69.18,42.6 69.18,59.11 | 69.18,59.11 70.99,60.92 P21-30.8 | v14.69,22.29 10.24,17.83 NOT.1 | v23.77,22.29 25.59,24.11 27.74,24.11 v31.37,27.74 | v43.59,40.62 43.59,40.95 47.71,45.07 47.71,46.23 48.54,47.05 51.02,47.05 64.88,60.92 8085-MPU.28 65.05,60.92 66.86,59.11 69.18,59.11
A15*
  Bottom 0.356: NOT.2 10.24,15.19 15.52,15.19 16.68,14.03 50.85,14.03 52.17,15.35 57.12,15.35 RAM-62256P.20
AD0  (via drill 0.61)
  Top 0.356: v74.95,69.84 72.48,72.31 59.11,72.31 50.35,63.56 49.53,63.56 8085-MPU.12 49.53,63.4 47.71,61.58 v47.71,59.44 | v44.74,22.78 44.74,19.15 v45.07,18.82 | 45.07,13.37 v45.07,15.68 | 45.07,13.37 41.94,10.24 RAM-62256P.11 | ROM-58C256.11 67.2,10.24 59.44,10.24 58.12,11.56 47.05,11.56 45.24,13.37 45.07,13.37 | v45.9,54.65 42.1,54.65 39.29,51.84 39.29,49.86 v35,45.57 | v36.98,29.72 v36.98,34.01
  Bottom 0.356: 8085-MPU.12 49.53,63.56 43.09,63.56 P11-20.2 | v74.95,69.84 77.43,67.36 77.43,65.05 79.91,62.57 79.91,62.24 8254-COUNTER.8 | 37.97,24.11 43.42,24.11 v44.74,22.78 | 37.97,24.11 33.19,24.11 32.03,22.95 26.75,22.95 ADDLATCH.2 | v45.07,15.68 v45.07,18.82 | v47.71,59.44 47.71,56.46 v45.9,54.65 | v35,45.57 35,36.49 36.98,34.51 v36.98,34.01 | v36.98,29.72 37.97,28.73 37.97,24.11
AD1  (via drill 0.61)
  Top 0.356: v81.89,73.3 81.89,66.7 80.07,64.88 8254-COUNTER.7 | v74.95,72.48 72.48,74.95 63.56,74.95 v61.91,73.3 | v51.84,63.23 49.53,60.92 8085-MPU.13 | ROM-58C256.12 67.2,7.76 66.04,8.91 55.97,8.91 55.14,9.74 48.04,9.74 46.06,7.76 41.94,7.76 RAM-62256P.12 39.95,9.58 39.95,11.89 35.83,16.02 v35.83,16.51 | v36.16,61.75 36.82,61.09 42.93,61.09 P11-20.3 | v25.76,58.45 21.79,58.45 11.56,48.21 11.56,42.27 14.53,39.29 v14.53,35.5
  Bottom 0.356: 8085-MPU.13 49.53,61.09 46.39,61.09 45.9,61.58 43.59,61.58 43.09,61.09 P11-20.3 | v81.89,73.3 81.39,73.3 81.06,73.64 77.93,73.64 76.77,72.48 v74.95,72.48 | v51.84,63.23 v61.91,73.3 | 24.77,18.16 26.58,19.98 26.58,20.31 ADDLATCH.3 | 24.77,18.16 24.77,17.34 25.59,16.51 v35.83,16.51 | v36.16,61.75 34.84,61.75 31.53,58.45 v25.76,58.45 | v14.53,35.5 14.53,35 19.15,30.38 19.15,19.81 20.8,18.16 24.77,18.16
AD2  (via drill 0.61)
  Top 0.356: 8085-MPU.14 49.53,58.45 43.26,58.45 P11-20.4 | RAM-62256P.13 41.94,5.12 45.4,5.12 48.37,8.09 52.5,8.09 54.32,6.27 66.04,6.27 67.2,5.12 ROM-58C256.13 67.36,5.12 70,7.76 70,10.9 69.18,11.72 69.18,18.33 | v54.98,22.62 56.13,21.46 63.73,21.46 66.2,18.99 68.52,18.99 69.18,18.33 | v87.34,24.11 86.18,24.11 83.54,21.46 72.48,21.46 69.34,18.33 69.18,18.33 | 82.72,53.33 82.72,51.68 90.81,43.59 90.81,29.88 88.99,28.07 DISP.7 | 82.72,53.33 v82.72,64.55 | v59.77,58.28 62.57,58.28 63.73,57.12 75.12,57.12 78.92,53.33 82.72,53.33
  Bottom 0.356: v54.98,22.62 50.35,22.62 48.87,21.13 43.42,21.13 43.09,21.46 33.02,21.46 29.39,17.83 26.75,17.83 ADDLATCH.4 | v87.34,24.11 87.01,24.43 87.01,26.09 88.82,27.9 DISP.7 | v82.72,64.55 80.07,67.2 8254-COUNTER.6 | v59.77,58.28 49.53,58.28 8085-MPU.14
AD3  (via drill 0.61)
  Top 0.356: 8085-MPU.15 49.53,55.97 43.26,55.97 P11-20.5 | v76.94,69.34 72.31,64.72 63.56,64.72 58.12,59.27 58.12,58.12 v55.97,55.97 | v24.77,6.11 24.77,13.37 26.58,15.19 ADDLATCH.5 26.58,15.35 24.77,17.17 24.77,40.78 27.9,43.92 v27.9,50.52 | ROM-58C256.15 82.55,2.48 69.67,2.48 68.52,1.32 58.45,1.32 57.29,2.48 RAM-62256P.15
  Bottom 0.356: v76.94,69.34 77.43,69.84 79.91,69.84 8254-COUNTER.5 | v55.97,55.97 49.53,55.97 8085-MPU.15 | v24.77,6.11 24.77,4.62 25.59,3.8 55.97,3.8 57.12,2.64 RAM-62256P.15 | DISP.6 88.99,30.38 90.81,28.56 90.81,16.34 87.01,12.55 87.01,6.77 82.88,2.64 82.55,2.64 ROM-58C256.15 | v27.9,50.52 29.39,52.01 32.19,52.01 33.02,52.83 33.02,53.82 35,55.8 43.09,55.8 P11-20.5
AD4  (via drill 0.61)
  Top 0.356: P11-20.6 43.26,53.33 49.53,53.33 8085-MPU.16 49.7,53.33 63.73,67.36 73.97,67.36 75.95,69.34 75.95,69.84 v76.77,70.66 | ROM-58C256.16 82.55,5.28 85.36,8.09 v85.36,8.75 86.68,8.75 93.12,15.19 98.23,15.19 99.39,14.03 115.57,14.03 117.55,16.02 117.55,29.72 115.57,31.7 113.09,31.7 112.27,32.52 112.27,35.5 105.83,41.94 101.21,41.94 97.9,45.24 97.9,46.06 84.7,59.27 v84.7,67.69
  Bottom 0.356: v76.77,70.66 78.42,72.31 79.91,72.31 8254-COUNTER.4 80.07,72.31 v84.7,67.69 | ADDLATCH.6 26.75,12.55 29.55,12.55 33.19,8.91 42.93,8.91 46.23,5.61 46.23,4.95 46.72,4.46 56.63,4.46 57.12,4.95 RAM-62256P.16 57.29,4.95 60.92,1.32 68.52,1.32 72.15,4.95 82.55,4.95 ROM-58C256.16 | DISP.5 88.16,33.02 85.69,30.54 85.69,12.38 85.03,11.72 85.03,9.08 v85.36,8.75
AD5  (via drill 0.61)
  Top 0.356: v75.12,83.71 73.47,83.71 72.31,82.55 v69.51,82.55 | v32.03,7.59 33.35,6.27 38.3,6.27 40.78,3.8 45.57,3.8 v47.22,5.45 | v86.02,11.23 82.55,7.76 ROM-58C256.17 | v61.25,46.89 57.45,50.69 49.53,50.69 8085-MPU.17 | v66.7,44.58 69.84,44.58 70,44.41 74.13,44.41 v77.93,40.62
  Bottom 0.356: P11-20.7 43.26,50.85 49.53,50.85 8085-MPU.17 49.7,50.85 53.82,50.85 60.76,57.78 60.76,59.27 63.73,62.24 65.88,62.24 66.7,63.07 66.7,79.41 69.51,82.22 v69.51,82.55 | v75.12,83.71 77.43,81.39 77.43,76.77 79.25,74.95 79.91,74.95 8254-COUNTER.3 | ROM-58C256.17 82.55,7.59 73.8,7.59 70,3.8 65.71,3.8 61.91,7.59 57.29,7.59 RAM-62256P.17 54.65,5.12 52.5,5.12 52.17,5.45 v47.22,5.45 | v32.03,7.59 29.55,10.07 26.75,10.07 ADDLATCH.7 | v86.02,11.23 86.35,11.56 86.35,30.21 87.83,31.7 89.98,31.7 90.81,32.52 90.81,33.68 88.99,35.5 DISP.4 88.82,35.66 88,35.66 86.35,37.31 86.35,38.47 84.2,40.62 v77.93,40.62 | v61.25,46.89 63.56,44.58 v66.7,44.58
AD6  (via drill 0.61)
  Top 0.356: 8085-MPU.18 49.53,48.37 43.42,48.37 P11-20.8 | v53,6.11 48.21,1.32 33.02,1.32 26.75,7.59 ADDLATCH.8 | v96.58,16.68 88.99,16.68 82.55,10.24 ROM-58C256.18 | v88.82,64.22 v88.82,69.51 | v66.7,52.01 75.29,52.01 v85.69,41.6
  Bottom 0.356: v53,6.11 57.12,10.24 RAM-62256P.18 57.29,10.07 60.43,10.07 64.06,6.44 68.52,6.44 72.15,10.07 82.55,10.07 ROM-58C256.18 | v96.58,16.68 93.28,19.98 93.28,34.51 89.81,37.97 88.99,37.97 DISP.3 | v88.82,69.51 80.9,77.43 80.07,77.43 8254-COUNTER.2 | v88.82,64.22 88.82,45.57 90.81,43.59 90.81,39.13 89.81,38.14 DISP.3 | v66.7,52.01 63.56,52.01 51.18,39.62 43.09,39.62 41.27,41.44 41.27,46.23 43.26,48.21 P11-20.8 | v85.69,41.6 85.69,41.27 88.82,38.14 DISP.3
AD7  (via drill 0.61)
  Top 0.356: v44.08,6.27 45.57,6.27 48.04,8.75 v53.33,8.75 | 8085-MPU.19 49.53,45.73 43.42,45.73 P11-20.9 | v66.7,54.48 69.84,54.48 70,54.65 75.12,54.65 76.19,53.58 | v79.25,50.52 76.19,53.58 | 76.19,53.58 v75.62,53
  Bottom 0.356: v44.08,6.27 33.19,6.27 32.03,5.12 26.75,5.12 ADDLATCH.9 | v53.33,8.75 57.12,12.55 RAM-62256P.19 57.29,12.55 58.28,11.56 68.52,11.56 69.51,12.55 82.55,12.55 ROM-58C256.19 82.72,12.71 82.72,13.04 84.37,14.69 84.37,15.85 83.71,16.51 81.39,16.51 80.73,17.17 80.73,18.33 81.56,19.15 83.71,19.15 84.37,19.81 84.37,33.52 83.54,34.34 81.39,34.34 75.78,39.95 75.78,52.83 v75.62,53 | 81.89,50.52 81.89,55.14 81.06,55.97 78.75,55.97 78.09,56.63 78.09,60.1 79.08,61.09 81.23,61.09 85.69,65.55 85.69,71.65 81.06,76.28 78.92,76.28 78.09,77.1 78.09,78.09 8254-COUNTER.1 | 81.89,50.52 81.89,47.71 88.82,40.78 DISP.2 | v66.7,54.48 63.56,54.48 54.81,45.73 49.53,45.73 8085-MPU.19 | 81.89,50.52 v79.25,50.52
ALE
  Top 0.356: ADDLATCH.11 34.18,2.64 28.56,8.26 28.56,31.37 26.25,33.68 26.25,41.27 29.55,44.58 36.49,44.58 41.44,49.53 45.9,49.53 48.54,52.17 50.69,52.17 57.45,58.94 57.45,59.6 63.89,66.04 8085-MPU.30 P21-30.10
CLK1
  Top 0.356: 8254-COUNTER.15 95.26,57.29 96.25,57.29 100.22,61.25 100.22,91.3 COUNTER1.1
CLK2
  Top 0.356: 8254-COUNTER.18 95.26,64.72 97.08,62.9 97.08,59.11 96.42,58.45 92.13,58.45 85.69,64.88 85.69,84.37 78.75,91.3 COUNTER2.1
CLK_OUT
  Top 0.356: 8085-MPU.37 64.88,83.87 70.99,83.87 P31-40.7 71.16,83.87 76.44,89.15 76.44,92.95 77.93,94.44 87.17,94.44 COUNTER0.1
  Bottom 0.356: 8254-COUNTER.9 80.07,59.77 80.9,59.77 90.14,69.01 90.14,91.3 COUNTER0.1
D4
  Top 0.356: DISP.16 105.83,33.02 113.42,25.43 114.25,25.43 LCD.6
D5
  Top 0.356: DISP.17 96.58,35.5 104.34,35.5 113.09,26.75 115.41,26.75 116.23,25.92 116.23,24.77 114.41,22.95 LCD.5
D6
  Bottom 0.356: DISP.18 96.42,37.97 94.6,36.16 94.6,27.57 95.59,26.58 101.7,26.58 106.98,21.3 113.42,21.3 114.25,20.47 LCD.4
D7
  Bottom 0.356: LCD.3 111.44,20.64 106.66,20.64 103.19,24.11 95.43,24.11 93.94,25.59 93.94,37.81 96.42,40.28 96.42,40.62 DISP.19
DCS  (via drill 0.61)
  Top 0.356: v33.52,66.04 33.52,65.38 31.7,63.56 29.39,63.56 25.59,59.77 22.95,59.77 AND.6 | v39.79,73.47 40.45,73.47 41.94,74.95 v47.88,74.95 | v83.71,81.39 83.71,51.68 94.6,40.78 94.6,22.29 96.42,20.47 DISP.11
  Bottom 0.356: v33.52,66.04 39.79,72.31 v39.79,73.47 | v47.88,74.95 50.69,74.95 62.9,87.17 62.9,91.96 66.2,95.26 70.33,95.26 71.16,94.44 71.16,93.45 71.82,92.79 72.31,92.79 v83.71,81.39
EN
  Bottom 0.356: DISP.14 96.58,28.07 102.53,28.07 112.43,37.97 114.25,37.97 LCD.11
GATE1
  Top 0.356: 8254-COUNTER.14 95.26,54.65 102.2,61.58 102.2,90.64 102.86,91.3 COUNTER1.2
GATE2
  Top 0.356: 8254-COUNTER.16 95.1,59.77 91.8,59.77 86.35,65.22 86.35,86.35 81.39,91.3 COUNTER2.2
GND  (via drill 0.61)
  Top 0.61: v50.52,7.1 46.06,2.64 41.94,2.64 RAM-62256P.14 | v53,13.7 55.8,16.51 v65.71,16.51 | ROM-58C256.14 67.36,2.64 70.83,6.11 70.83,11.23 70,12.05 70,14.53 70.17,14.69 v70.17,15.02 70.33,15.19 79.91,15.19 81.23,16.51 85.03,16.51 88.66,20.14 DISP.10 | RESET.4 97.24,3.96 101.87,3.96 102.2,3.63 103.85,3.63 105.17,4.95 C8.- 105.5,5.12 105.5,10.07 C29.2 105.66,10.24 107.97,12.55 114.25,12.55 LCD.1 114.58,12.71 115.41,12.71 118.38,15.68 118.38,36.82 114.58,40.62 LCD.12 114.25,40.78 108.14,40.78 105.66,43.26 C_1.2 103.02,45.57 99.06,45.57 C1.2 | DISP.10 88.99,20.47 88.99,22.78 DISP.9 88.99,23.11 88.99,25.26 DISP.8 88.66,25.59 85.36,28.89 85.36,37.97 C18.2 85.19,38.14 85.19,39.46 88.82,43.09 DISP.1 8254-COUNTER.12 | U$1.P$1 102.86,17.83 94.11,17.83 91.63,20.31 89.15,20.31 DISP.10 | R7.1 36.98,53.49 34.34,53.49 C25.2 34.18,53.16 34.18,49.03 v34.01,48.87 | R8.1 38.14,44.41 42.1,44.41 43.26,43.26 P11-20.10 43.59,43.26 49.37,43.26 8085-MPU.20 49.53,43.09 53.99,43.09 58.94,38.14 59.6,38.14 C19.2 | v47.05,40.62 45.9,39.46 43.26,39.46 38.8,35 38.8,29.88 36.98,28.07 C26.2 | 13.54,16.51 13.54,23.77 13.87,24.11 DHT-11.1 | 13.54,16.51 13.54,5.94 10.24,2.64 NOT.7 | 20.47,16.51 20.47,20.31 C27.2 | 20.47,16.51 20.47,8.75 26.58,2.64 ADDLATCH.10 | 20.47,16.51 13.54,16.51 | R6.1 37.97,64.88 37.97,70.66 36.82,71.82 36.82,73.64 37.97,74.79 R5.1 | 20.8,44.41 21.46,44.41 22.62,43.26 MEM-DEC.4 22.95,43.09 22.95,40.78 MEM-DEC.5 22.62,40.45 20.8,38.63 20.8,35 22.78,33.02 MEM-DEC.8 | 20.8,44.41 15.35,44.41 T1.1 | 20.8,44.41 20.8,51.35 22.78,53.33 22.78,57.12 AND.7 | R4.1 38.14,85.19 v40.95,88 40.45,88.49 40.45,92.29 v37.81,94.93
  Top 0.61: USB.GND 115.57,83.38 109.63,83.38 107.97,85.03 C16.2 | 113.26,63.56 111.77,63.56 PWR.K | 113.26,63.56 118.05,68.35 PWR5.2 | LCD.16 113.42,51.68 113.42,63.4 113.26,63.56 | C20.2 72.48,94.11 74.46,94.11 76.94,96.58 92.79,96.58 97.74,91.63 97.74,83.87 C2.2
  Bottom 0.61: v50.52,7.1 50.52,11.23 v53,13.7 | v65.71,16.51 68.68,16.51 v70.17,15.02 | 8254-COUNTER.12 76.28,55.8 76.28,66.04 R3.1 | LCD.1 114.25,12.71 113.09,13.87 112.93,13.87 109.96,16.84 109.96,18.49 108.64,19.81 105,19.81 103.02,17.83 U$1.P$1 | C25.2 34.34,53.33 34.34,51.51 37.97,47.88 37.97,44.58 R8.1 | v47.05,40.62 49.53,43.09 8085-MPU.20 | C27.2 22.62,22.62 22.62,22.78 25.09,25.26 | 25.09,25.26 26.58,25.26 ADDLATCH.1 | 25.09,25.26 22.95,27.41 22.95,33.02 MEM-DEC.8 | 33.68,74.95 37.97,74.95 R5.1 | 33.68,74.95 33.02,74.95 C3.2 | R6.1 37.97,64.88 32.85,64.88 31.7,66.04 29.22,66.04 24.93,61.75 24.93,59.27 22.95,57.29 AND.7 | v34.01,48.87 32.36,48.87 31.7,49.53 29.22,49.53 22.95,43.26 MEM-DEC.4 | v40.95,88 40.95,91.8 42.27,93.12 51.35,93.12 53.33,95.1 C7.2 53.49,95.43 54.15,96.09 70.66,96.09 72.31,94.44 72.31,94.11 C20.2 | 106.66,83.87 97.9,83.87 C2.2 | 106.66,83.87 107.81,85.03 C16.2 | 106.66,83.87 106.66,81.89 107.81,80.73 107.81,77.6 C17.- 108.14,77.27 109.13,77.27 118.05,68.35 PWR5.2 | LCD.16 114.25,50.69 112.93,50.69 105.5,43.26 C_1.2 | 33.68,74.95 33.68,91.14 37.48,94.93 v37.81,94.93
HLDA
  Top 0.356: 8085-MPU.38 64.88,86.35 70.99,86.35 P31-40.8
HOLD
  Top 0.356: 8085-MPU.39 64.88,88.99 70.99,88.99 P31-40.9
  Bottom 0.356: R3.2 76.11,73.8 76.11,75.78 74.62,77.27 74.62,81.39 73.14,82.88 73.14,86.84 71.16,88.82 P31-40.9
INTA*
  Top 0.356: 8085-MPU.11 43.09,66.04 P11-20.1
INTR
  Top 0.356: 8085-MPU.10 49.53,68.68 43.26,68.68 P1-10.10
  Bottom 0.356: R4.2 38.14,92.62 38.14,88.99 42.1,85.03 44.41,85.03 46.89,82.55 46.89,71.32 49.53,68.68 8085-MPU.10
IO/M*
  Top 0.356: MEM-DEC.3 22.95,45.73 22.95,46.06 26.91,50.02 26.91,51.18 34.51,58.78 34.51,76.61 37.97,80.07 60.1,80.07 63.89,76.28 64.72,76.28 8085-MPU.34 64.88,76.28 70.99,76.28 P31-40.4
IOR*  (via drill 0.61)
  Top 0.356: v31.7,73.97 31.7,75.29 37.81,81.39 40.78,81.39 41.94,82.55 53.49,82.55 63.73,92.79 74.3,92.79 77.27,95.76 90.81,95.76 93.94,92.62 93.94,86.84 96.58,84.2 96.58,81.06 97.08,80.57 97.08,76.77 95.26,74.95 8254-COUNTER.22
  Bottom 0.356: v31.7,73.97 31.37,73.64 29.39,73.64 28.56,72.81 28.56,70.66 23.94,66.04 21.79,66.04 19.98,64.22 19.98,42.76 20.31,42.43 20.31,40.78 21.63,39.46 24.77,39.46 28.56,35.66 30.38,35.66 MEM-DEC.10
IOW
  Top 0.356: NOT.4 10.07,10.24 8.26,12.05 8.26,48.37 21.96,62.08 22.78,62.08 AND.5
IOW*  (via drill 0.61)
  Top 0.356: v20.97,31.2 15.19,25.43 12.71,25.43 12.05,24.77 12.05,14.53 10.24,12.71 NOT.3 10.24,12.55 12.05,10.73 12.05,9.74 11.23,8.91 9.08,8.91 7.59,10.4 7.59,67.86 38.47,98.73 91.8,98.73 99.06,91.47 99.06,76.44 96.25,73.64 94.11,73.64 93.45,74.3 93.45,75.45 95.1,77.1 95.1,77.43 8254-COUNTER.23 | v27.24,34.18 29.22,34.18 30.38,33.02 MEM-DEC.9
  Bottom 0.356: v20.97,31.2 20.97,33.52 21.63,34.18 v27.24,34.18
MR*  (via drill 0.61)
  Top 0.356: v36.32,37.64 v32.03,41.94 | v39.95,34.01 39.95,32.69 40.95,31.7 53.49,31.7 v54.98,30.21
  Bottom 0.356: v32.03,41.94 32.36,42.27 32.36,43.75 30.54,45.57 MEM-DEC.14 | v39.95,34.01 v36.32,37.64 | v54.98,30.21 55.97,29.22 69.18,29.22 | 69.18,29.22 73.14,29.22 81.89,20.47 82.55,20.47 ROM-58C256.22 | 69.18,29.22 69.18,19.81 68.52,19.15 66.04,19.15 64.88,20.31 57.29,20.31 RAM-62256P.22
MW*
  Top 0.356: MEM-DEC.13 30.54,43.09 40.95,43.09 42.43,41.6 48.54,41.6 57.12,33.02 RAM-62256P.27
N$2  (via drill 2.8)
  other vias: 5.08,95.25
N$3  (via drill 2.8)
  other vias: 118.11,95.25
N$4
  Bottom 0.356: LCD.14 114.41,45.57 116.23,43.75 116.23,35 115.57,34.34 113.09,34.34 105.5,26.75 105.5,25.43 U$1.P$3
N$5
  Top 0.356: R11.1 18.99,40.62 18.99,38.47 14.03,33.52 14.03,29.22 DHT-11.3
N$6  (via drill 2.8)
  other vias: 118.11,5.08
N$7
  Bottom 0.356: T1.2 13.87,46.23 12.71,46.23 11.56,45.07 11.56,42.27 18.99,34.84 18.99,33.02 R1.1
N$8  (via drill 2.8)
  other vias: 5.08,5.08
N$18
  Top 0.356: LCD.2 116.89,17.83 116.89,27.9 115.57,29.22 113.09,29.22 105.5,36.82 R12.2
N$39
  Top 0.356: R14.2 104.18,72.31 104.18,68.52 109.13,63.56 PWR.A
OUT
  Bottom 0.356: 8254-COUNTER.10 80.07,57.29 92.79,70 92.79,88.99 95.1,91.3 COUNTER0.3
OUT1
  Top 0.356: 8254-COUNTER.13 95.26,52.17 102.86,59.77 102.86,88.82 105.33,91.3 COUNTER1.3
OUT2
  Top 0.356: 8254-COUNTER.17 95.1,62.24 95.1,62.57 89.81,67.86 89.81,85.36 83.87,91.3 COUNTER2.3
RD*  (via drill 0.61)
  Top 0.356: v41.44,57.12 50.85,57.12 64.72,70.99 8085-MPU.32 64.88,71.16 70.99,71.16 P31-40.2
  Bottom 0.356: v41.44,57.12 35.33,57.12 32.85,54.65 31.37,54.65 31.04,54.32 30.21,54.32 24.27,48.37 22.95,48.37 MEM-DEC.2
READY
  Top 0.356: 8085-MPU.35 64.88,78.75 70.99,78.75 P31-40.5 71.16,78.75 71.65,78.75 76.11,83.21 76.11,85.03 R2.2
RES_IN
  Top 0.356: 8085-MPU.36 64.88,81.39 70.99,81.39 P31-40.6 | 97.74,10.24 97.74,9.25 97.24,8.75 RESET.2 | 97.74,10.24 97.74,13.87 R9.2 | 97.74,10.24 102.86,10.24 C29.1 102.86,10.07 102.86,5.12 C8.+
  Bottom 0.356: P31-40.6 71.16,81.23 73.97,78.42 73.97,56.13 78.09,52.01 78.09,47.71 87.01,38.8 87.01,37.64 87.83,36.82 89.98,36.82 92.62,34.18 92.62,19.15 97.74,14.03 R9.2
RES_OUT
  Top 0.356: 8085-MPU.3 49.53,86.35 43.26,86.35 P1-10.3
RS
  Bottom 0.356: DISP.15 96.58,30.54 101.7,30.54 114.25,43.09 LCD.13
RST5_5
  Top 0.356: 8085-MPU.9 49.53,71.16 43.26,71.16 P1-10.9
  Bottom 0.356: R5.2 38.14,82.55 38.14,76.61 41.27,73.47 41.27,72.97 43.09,71.16 P1-10.9
RST6_5
  Top 0.356: R6.2 38.14,72.48 41.94,72.48 43.09,73.64 P1-10.8 43.26,73.8 49.53,73.8 8085-MPU.8
RST7_5  (via drill 0.61)
  Top 0.356: DHT-11.2 14.03,26.75 17.83,30.54 17.83,35.66 18.99,36.82 R10.1 | 8085-MPU.7 49.53,76.28 43.26,76.28 P1-10.7 | v21.63,55.64 12.71,46.72 12.71,44.58 T1.3 | 59.93,81.23 63.73,77.43 74.13,77.43 77.93,73.64 77.93,56.63 79.91,54.65 8254-COUNTER.11 | 59.93,81.23 49.53,81.23 8085-MPU.5 49.37,81.23 43.26,81.23 P1-10.5 | 59.93,81.23 59.93,83.87 63.73,87.67 72.31,87.67 73.14,88.49 73.14,90.64 77.6,95.1 88.99,95.1 92.62,91.47 COUNTER0.2
  Bottom 0.356: R10.1 18.99,36.98 18.99,37.64 12.71,43.92 12.71,44.41 T1.3 | P1-10.7 43.26,76.11 45.24,74.13 45.24,70.66 44.41,69.84 41.94,69.84 40.95,68.85 40.95,65.88 38.14,63.07 38.14,62.24 R7.2 37.97,62.08 31.86,55.97 30.71,55.97 30.38,55.64 v21.63,55.64 | 8085-MPU.7 49.53,76.28 47.71,78.09 47.71,79.41 49.53,81.23 8085-MPU.5
S0
  Top 0.356: 8085-MPU.29 64.88,63.56 70.99,63.56 P21-30.9
S1
  Top 0.356: 8085-MPU.33 64.88,73.8 70.99,73.8 P31-40.3
SOD  (via drill 0.61)
  Top 0.356: v35.5,82.22 28.56,75.29 28.56,65.55 24.11,61.09 21.96,61.09 10.24,49.37 10.24,36.32 11.39,35.17 11.39,33.02 R1.2 | 8085-MPU.4 49.53,83.87 43.26,83.87 P1-10.4
  Bottom 0.356: v35.5,82.22 35.99,82.22 37.48,83.71 43.09,83.71 P1-10.4
TRAP  (via drill 0.61)
  Top 0.356: v45.4,60.59 45.4,61.75 48.54,64.88 50.69,64.88 51.35,65.55 51.35,76.77 49.53,78.59 8085-MPU.6 49.37,78.75 43.26,78.75 P1-10.6
  Bottom 0.356: v45.4,60.59 45.4,55.64 44.41,54.65 42.1,54.65 39.62,52.17 38.14,52.17 R8.2
VCC  (via drill 0.61)
  Top 0.61: ROM-58C256.27 ROM-58C256.28 82.55,37.15 | 82.55,37.15 C18.1 | RAM-62256P.28 57.29,35.66 57.29,37.97 C19.1 | MEM-DEC.16 30.54,50.85 30.54,52.17 31.7,53.33 C25.1 | v70.99,37.15 82.55,37.15 | v63.23,37.15 v67.69,37.15 | AND.14 30.54,72.48 30.54,74.79 C3.1 30.71,75.12 30.71,75.78 36.65,81.72 36.65,95.76 38.8,97.9 66.04,97.9 69.84,94.11 C20.1 | NOT.14 17.83,17.83 17.83,20.31 C27.1 | R10.2 11.56,36.98 11.56,40.62 R11.2 | v40.95,39.29 40.62,39.29 34.34,33.02 34.34,28.07 C26.1 | U$1.P$2 107.81,17.83 107.81,25.76 105.5,28.07 105.5,29.06 R12.1 105.17,29.39 104.34,29.39 v101.7,32.03 | C1.1 96.58,45.57 96.58,43.26 DISP.20 96.75,43.09 99.06,40.78 105.33,40.78 C_1.1 | 113.59,79.41 111.11,79.41 107.97,82.55 C16.1 | 113.59,79.41 115.57,79.41 USB.VBUS | 113.59,75.62 114.08,75.12 114.25,75.12 118.05,71.32 PWR5.1 | 113.59,79.41 113.59,75.62 | 8254-COUNTER.24 95.26,80.07 95.26,83.71 C2.1 95.1,83.87 85.36,93.61 78.26,93.61 77.27,92.62 77.27,90.31 77.6,89.98 77.6,83.54 76.28,82.22 76.28,77.6 R2.1 | C17.+ 108.47,75.45 113.42,75.45 113.59,75.62 | LCD.15 114.25,48.37 113.26,49.37 113.09,49.37 104.18,58.28 104.18,64.72 R14.1
  Bottom 0.61: 41.11,39.62 36.16,44.58 36.16,48.37 33.85,50.69 30.54,50.69 MEM-DEC.16 | 41.11,39.62 42.6,38.14 57.12,38.14 C19.1 | v67.69,37.15 v70.99,37.15 | v63.23,37.15 60.59,37.15 59.11,35.66 57.29,35.66 RAM-62256P.28 | ADDLATCH.20 34.34,25.43 34.34,27.9 C26.1 34.01,28.07 32.85,28.07 28.4,32.52 28.4,34.67 25.09,37.97 22.95,37.97 MEM-DEC.6 22.62,38.14 19.65,38.14 16.51,41.27 16.51,45.73 14.53,47.71 10.73,47.71 | C27.1 17.67,20.47 17.67,30.71 11.56,36.82 R10.2 | 10.73,47.71 10.73,41.44 11.39,40.78 R11.2 | 10.73,47.71 10.73,62.74 22.78,74.79 30.38,74.79 C3.1 | v40.95,39.29 40.95,39.46 41.11,39.62 | R9.1 90.31,13.87 96.09,13.87 97.41,12.55 102.69,12.55 107.81,17.67 U$1.P$2 | R2.1 76.11,77.6 76.11,81.06 73.97,83.21 73.97,88.66 71.16,91.47 P31-40.10 | 8085-MPU.40 64.88,91.47 70.83,91.47 P31-40.10 | C20.1 70,93.94 70,91.63 P31-40.10 | LCD.15 114.25,48.21 112.93,48.21 105.5,40.78 C_1.1 105.17,40.45 101.7,36.98 v101.7,32.03 | 104.18,70.5 104.18,64.88 R14.1 | 104.18,70.5 107.81,74.13 107.81,74.79 C17.+ | 104.18,70.5 102.86,71.82 102.86,72.48 96.58,78.75 96.42,78.75 95.26,79.91 8254-COUNTER.24
WR*
  Top 0.356: P31-40.1 70.99,68.68 64.88,68.68 8085-MPU.31
  Bottom 0.356: MEM-DEC.1 22.95,50.85 25.76,50.85 29.88,54.98 30.71,54.98 31.04,55.31 32.52,55.31 38.3,61.09 40.78,61.09 41.94,62.24 58.45,62.24 64.72,68.52 8085-MPU.31
X1
  Top 0.356: 8085-MPU.1 49.53,91.47 43.26,91.47 P1-10.1 44.58,91.63 44.58,96.42 CRYSTAL.2
X2
  Top 0.356: CRYSTAL.1 39.46,96.42 39.46,94.44 41.27,92.62 41.27,90.81 P1-10.2 43.26,88.99 49.53,88.99 8085-MPU.2 49.53,89.15 51.35,90.97 51.35,91.96 50.85,92.46 50.85,95.1 C7.1

### Text on the board
tNames: ANSHUL CHAUHAN | 30EC14 | ASHISH KUMAR | 43EC14 | FOG DETECTION SYSTEM